# Altium schematic sheet STRWHL-S05-V00-Screen.SchDoc: Screen Interface (ER-TFTM035-6)
size A3; DrawnBy: Jonn Dillon; DocumentNumber: 5; Revision: 00; SheetNumber: 5; SheetTotal: 9; Project: Steering Wheel 2020
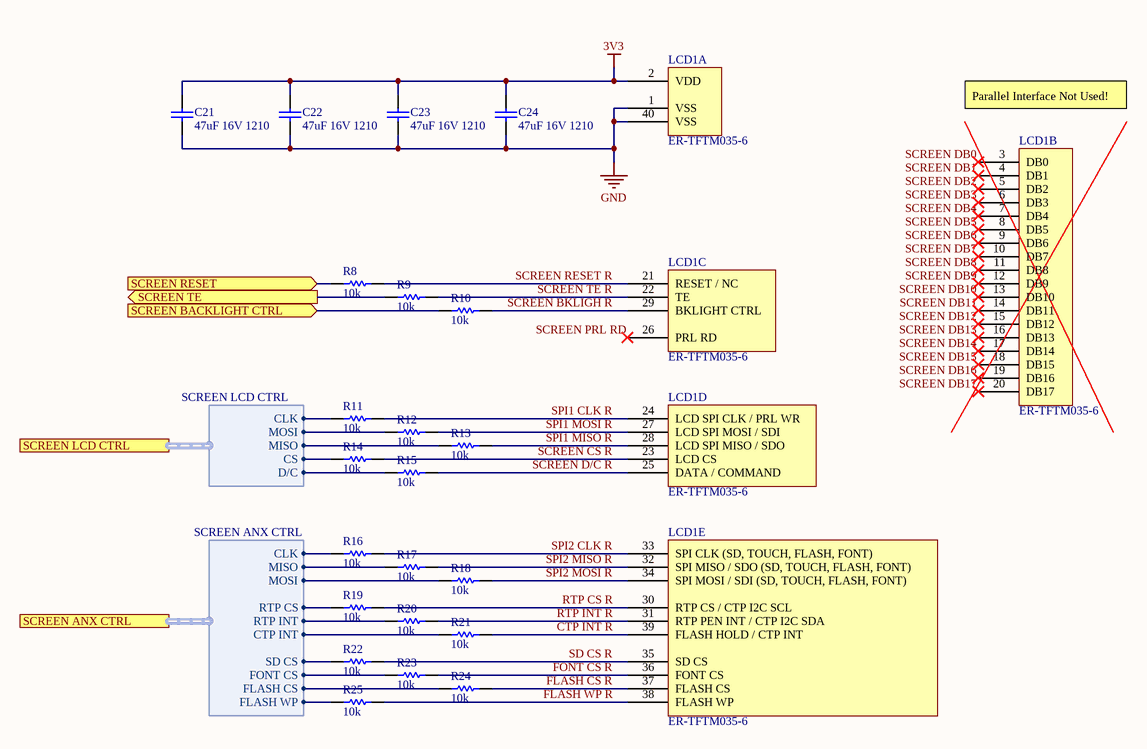
[diagram p0: STRWHL-S05-V00-Screen.SchDoc]

## Parts
C21  47uF 16V 1210  [Cap_Ceramic_1210]
C22  47uF 16V 1210  [Cap_Ceramic_1210]
C23  47uF 16V 1210  [Cap_Ceramic_1210]
C24  47uF 16V 1210  [Cap_Ceramic_1210]
LCD1  ER-TFTM035-6  [ER-TFTM035-6]  (parts A,B,C,D,E of 5)
R8  10k  [Res_ThinFilm_0603]
R9  10k  [Res_ThinFilm_0603]
R10  10k  [Res_ThinFilm_0603]
R11  10k  [Res_ThinFilm_0603]
R12  10k  [Res_ThinFilm_0603]
R13  10k  [Res_ThinFilm_0603]
R14  10k  [Res_ThinFilm_0603]
R15  10k  [Res_ThinFilm_0603]
R16  10k  [Res_ThinFilm_0603]
R17  10k  [Res_ThinFilm_0603]
R18  10k  [Res_ThinFilm_0603]
R19  10k  [Res_ThinFilm_0603]
R20  10k  [Res_ThinFilm_0603]
R21  10k  [Res_ThinFilm_0603]
R22  10k  [Res_ThinFilm_0603]
R23  10k  [Res_ThinFilm_0603]
R24  10k  [Res_ThinFilm_0603]
R25  10k  [Res_ThinFilm_0603]

## Ports
SCREEN ANX CTRL (harness SCREEN ANX CTRL), SCREEN BACKLIGHT CTRL (in), SCREEN LCD CTRL (harness SCREEN LCD CTRL), SCREEN RESET (in), SCREEN TE (out)

## Harnesses
SCREEN LCD CTRL: CLK, MOSI, MISO, CS, D/C
SCREEN ANX CTRL: CLK, MISO, MOSI, RTP CS, RTP INT, CTP INT, SD CS, FONT CS, FLASH CS, FLASH WP

## Nets
3V3: C21.2 C22.2 C23.2 C24.2 LCD1.2(VDD)
GND: C21.1 C22.1 C23.1 C24.1 LCD1.1(VSS) LCD1.40(VSS)
CTP INT R: LCD1.39(FLASH_HOLD_/_CTP_INT) R21.1
FLASH CS R: LCD1.37(FLASH_CS) R24.1
FLASH WP R: LCD1.38(FLASH_WP) R25.1
FONT CS R: LCD1.36(FONT_CS) R23.1
RTP CS R: LCD1.30(RTP_CS_/_CTP_I2C_SCL) R19.1
RTP INT R: LCD1.31(RTP_PEN_INT_/_CTP_I2C_SDA) R20.1
SCREEN BACKLIGHT CTRL: R10.2 ; port SCREEN BACKLIGHT CTRL
SCREEN BKLIGH R: LCD1.29(BKLIGHT_CTRL) R10.1
SCREEN CS R: LCD1.23(LCD_CS) R14.1
SCREEN D/C R: LCD1.25(DATA_/_COMMAND) R15.1
SCREEN DB0: LCD1.3(DB0)
SCREEN DB1: LCD1.4(DB1)
SCREEN DB2: LCD1.5(DB2)
SCREEN DB3: LCD1.6(DB3)
SCREEN DB4: LCD1.7(DB4)
SCREEN DB5: LCD1.8(DB5)
SCREEN DB6: LCD1.9(DB6)
SCREEN DB7: LCD1.10(DB7)
SCREEN DB8: LCD1.11(DB8)
SCREEN DB9: LCD1.12(DB9)
SCREEN DB10: LCD1.13(DB10)
SCREEN DB11: LCD1.14(DB11)
SCREEN DB12: LCD1.15(DB12)
SCREEN DB13: LCD1.16(DB13)
SCREEN DB14: LCD1.17(DB14)
SCREEN DB15: LCD1.18(DB15)
SCREEN DB16: LCD1.19(DB16)
SCREEN DB17: LCD1.20(DB17)
SCREEN PRL RD: LCD1.26(PRL_RD)
SCREEN RESET: R8.2 ; port SCREEN RESET
SCREEN RESET R: LCD1.21(RESET_/_NC) R8.1
SCREEN TE: R9.2 ; port SCREEN TE
SCREEN TE R: LCD1.22(TE) R9.1
SD CS R: LCD1.35(SD_CS) R22.1
SPI1 CLK R: LCD1.24(LCD_SPI_CLK_/_PRL_WR) R11.1
SPI1 MISO R: LCD1.28(LCD_SPI_MISO_/_SDO) R13.1
SPI1 MOSI R: LCD1.27(LCD_SPI_MOSI_/_SDI) R12.1
SPI2 CLK R: LCD1.33(SPI_CLK_(SD,_TOUCH,_FLASH,_FONT)) R16.1
SPI2 MISO R: LCD1.32(SPI_MISO_/_SDO_(SD,_TOUCH,_FLASH,_FONT)) R17.1
SPI2 MOSI R: LCD1.34(SPI_MOSI_/_SDI_(SD,_TOUCH,_FLASH,_FONT)) R18.1
NetR11_2: R11.2 ; port SCREEN LCD CTRL.CLK
NetR12_2: R12.2 ; port SCREEN LCD CTRL.MOSI
NetR13_2: R13.2 ; port SCREEN LCD CTRL.MISO
NetR14_2: R14.2 ; port SCREEN LCD CTRL.CS
NetR15_2: R15.2 ; port SCREEN LCD CTRL.D/C
NetR16_2: R16.2 ; port SCREEN ANX CTRL.CLK
NetR17_2: R17.2 ; port SCREEN ANX CTRL.MISO
NetR18_2: R18.2 ; port SCREEN ANX CTRL.MOSI
NetR19_2: R19.2 ; port SCREEN ANX CTRL.RTP CS
NetR20_2: R20.2 ; port SCREEN ANX CTRL.RTP INT
NetR21_2: R21.2 ; port SCREEN ANX CTRL.CTP INT
NetR22_2: R22.2 ; port SCREEN ANX CTRL.SD CS
NetR23_2: R23.2 ; port SCREEN ANX CTRL.FONT CS
NetR24_2: R24.2 ; port SCREEN ANX CTRL.FLASH CS
NetR25_2: R25.2 ; port SCREEN ANX CTRL.FLASH WP

## Notes on the sheet
- Parallel Interface Not Used!
- Revision History:
- Sheet Title:
- Rev
- Date
- Description
- Project:
- Size:
- Drawn By:
- A3
- Number:
- Revision:
- Sheet
- Version:
- of
- QUT Motorsport
- O-120, Gardens Point
- 2 George Street
- Brisbane, QLD 4000
- Australia
- Print Date:
- Print Time:
- File Name:

## Library data of the parts
C21-C24 = 47uF 16V 10% X7R 1210: Capacitor, Ceramic, SMD, 47uF, 16V, 5%, X7R, 1210
LCD1 = ER-TFTM035-6: LCD 3.5" 320x480 TFT Display Module, OPTL Touch Screen w/Breakout Board; ComponentLink1Description: Website; ComponentLink1URL: https://www.buydisplay.com/lcd-3-5-inch-320x480-tft-display-module-optl-touch-screen-w-breakout-board
R8-R25 = 10k 5% 0603: Resistor, SMD, 10k, 0.1W, 5%, 0603